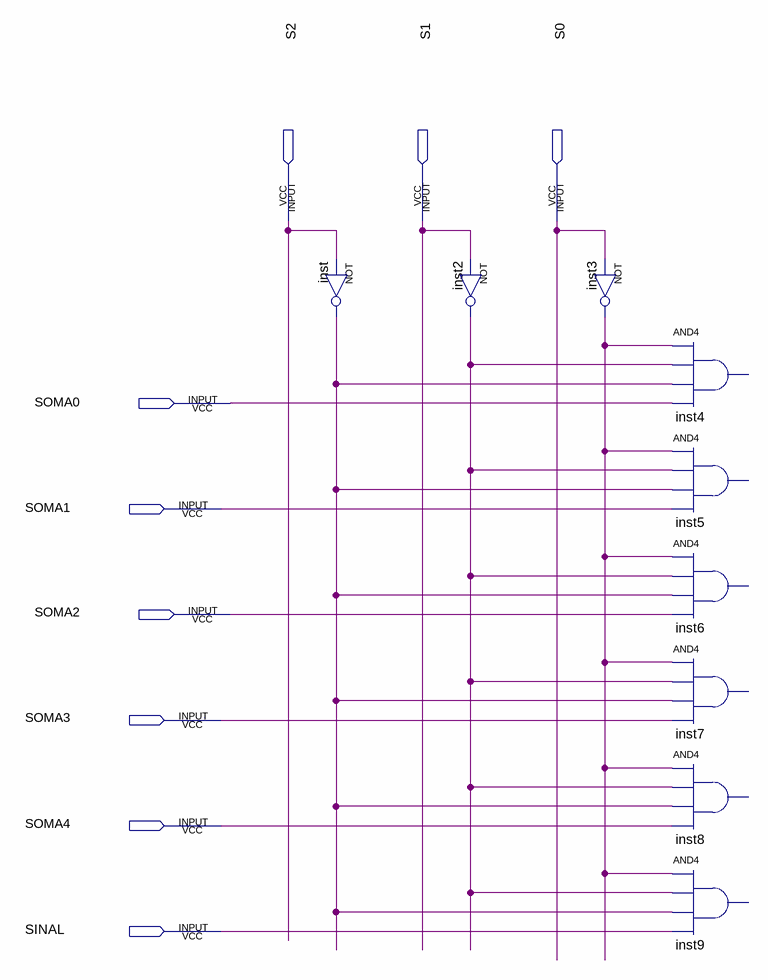
[diagram p0: schematic sheet]
// Quartus schematic Teste_MUX_Matheus.bdf as structural Verilog: 9 symbols, 9 pins
module Teste_MUX_Matheus (
  input  S2,
  input  S1,
  input  S0,
  input  SOMA0,
  input  SOMA1,
  input  SOMA2,
  input  SOMA3,
  input  SOMA4,
  input  SINAL
);

  wire inst2_out, inst3_out, inst_out;

  not inst (inst_out, S2);
  not inst2 (inst2_out, S1);
  not inst3 (inst3_out, S0);
  // AND4 inst4 has open pins: IN1=inst3_out, IN2=inst2_out, IN3=inst_out, IN4=SOMA0, OUT=open
  // AND4 inst5 has open pins: IN1=inst3_out, IN2=inst2_out, IN3=inst_out, IN4=SOMA1, OUT=open
  // AND4 inst6 has open pins: IN1=inst3_out, IN2=inst2_out, IN3=inst_out, IN4=SOMA2, OUT=open
  // AND4 inst7 has open pins: IN1=inst3_out, IN2=inst2_out, IN3=inst_out, IN4=SOMA3, OUT=open
  // AND4 inst8 has open pins: IN1=inst3_out, IN2=inst2_out, IN3=inst_out, IN4=SOMA4, OUT=open
  // AND4 inst9 has open pins: IN1=inst3_out, IN2=inst2_out, IN3=inst_out, IN4=SINAL, OUT=open
endmodule
